# Altium project PCB_Project_Node_Sensor.PrjPcb
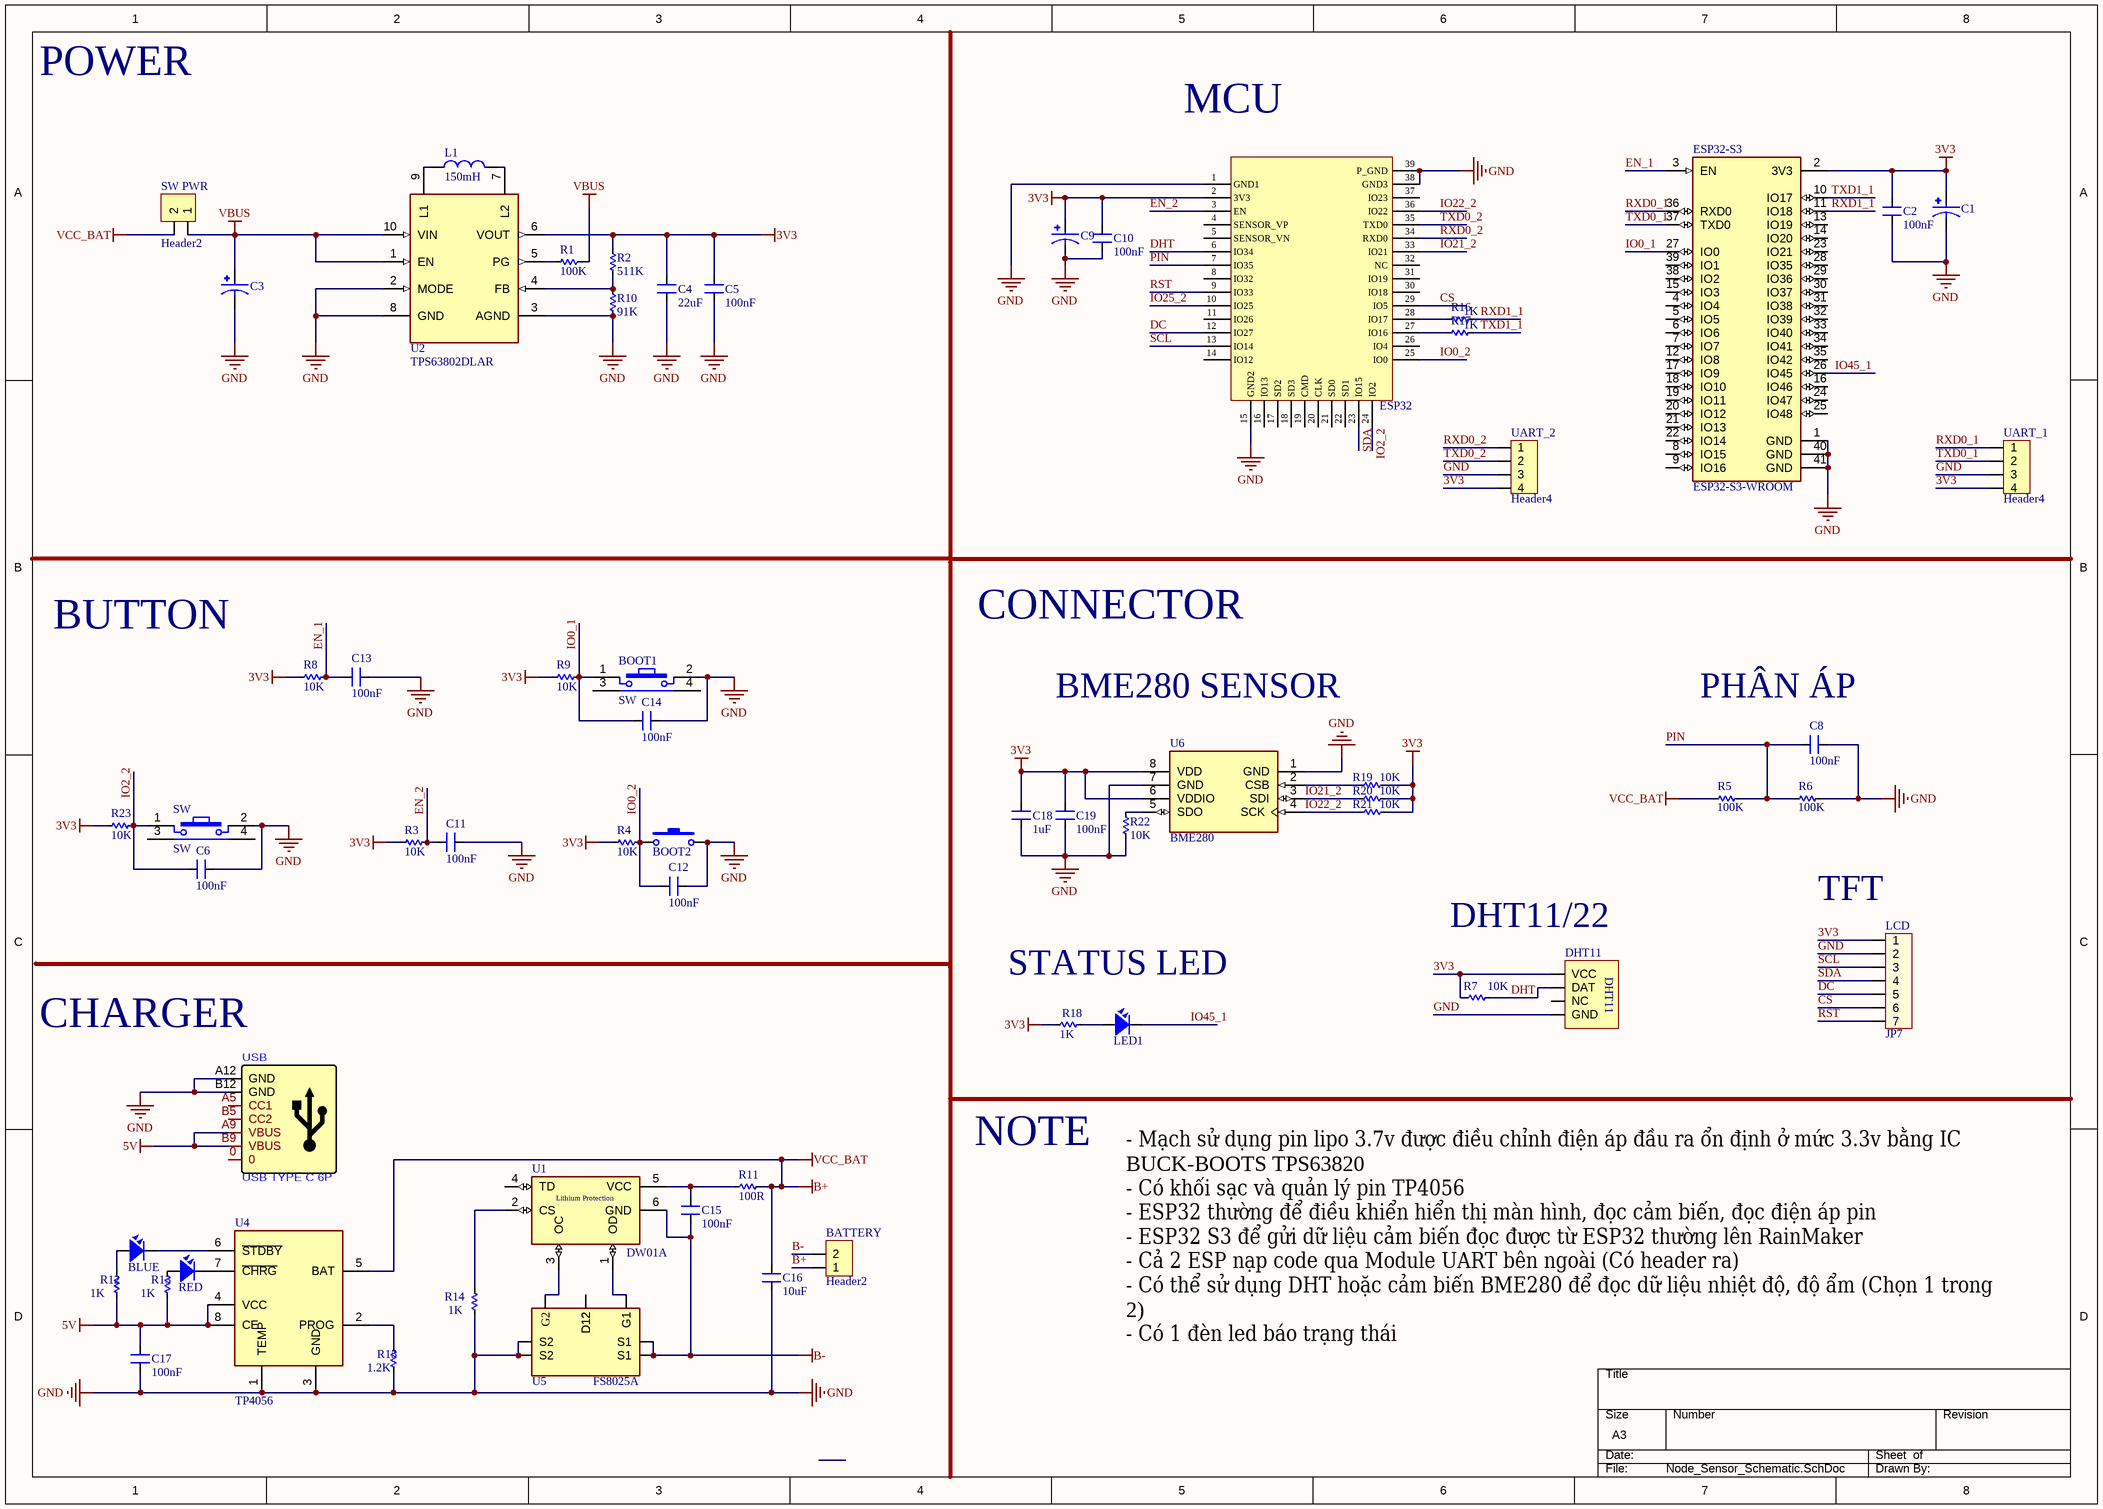
[diagram p0: Node_Sensor_Schematic.SchDoc]
1 sheet, 62 parts. Net scope: global (net labels, ports and power ports of the same name join across sheets).
Board file: PCB1.PcbDoc

## Sheet Node_Sensor_Schematic.SchDoc: Node_Sensor
size A3; Author: Chu Hà Nam; SheetNumber: 1; SheetTotal: 1

### Parts
BATTERY  Header2  [Header2]
BLUE  LED  [LED-0603]  (value not drawn)
BOOT1  SW  [TACTILE SWITCH TC-0203]
BOOT2  SW-SMD  [SW_B3U-1000P]  (value not drawn)
C1  CAP_TANTALUM_SMD  [CAP_TANTALUM_3216]  (value not drawn)
C2  100nF  [C-0603]
C3  10uF/16V  [CAP_TANTALUM_3216]  (value not drawn)
C4  22uF  [SM-0805]
C5  100nF  [SM-0805]
C6  100nF  [C-0603]
C8  100nF  [C-0603]
C9  CAP_TANTALUM_SMD  [CAP_TANTALUM_3216]  (value not drawn)
C10  100nF  [C-0603]
C11  100nF  [C-0603]
C12  100nF  [C-0603]
C13  100nF  [C-0603]
C14  100nF  [C-0603]
C15  100nF  [C-0603]
C16  10uF  [SM-0805]
C17  100nF  [C-0603]
C18  1uF  [C-0603]
C19  100nF  [C-0603]
DHT11  DHT11  [DHT11]  (value not drawn)
ESP32  ESP32  [ESP32-WROOM-32U]  (value not drawn)
ESP32-S3  ESP32-S3-WROOM  [ESP32-S3-WROOM-1]
L1  150mH  [INDUCTOR_SMD_4X4MM]
LCD  JP7  [653007114822]
LED1  LED  [LED-0603]  (value not drawn)
R1  100K  [RES-SMD-0603]
R2  511K  [RES-SMD-0603]
R3  10K  [RES-SMD-0603]
R4  10K  [RES-SMD-0603]
R5  100K  [RES-SMD-0603]
R6  100K  [RES-SMD-0603]
R7  10K  [RES-SMD-0603]
R8  10K  [RES-SMD-0603]
R9  10K  [RES-SMD-0603]
R10  91K  [RES-SMD-0603]
R11  100R  [RES-SMD-0603]
R12  1K  [RES-SMD-0603]
R13  1K  [RES-SMD-0603]
R14  1K  [RES-SMD-0603]
R15  1.2K  [RES-SMD-0603]
R16  1K  [RES-SMD-0603]
R17  1K  [RES-SMD-0603]
R18  1K  [RES-SMD-0603]
R19  10K  [RES-SMD-0603]
R20  10K  [RES-SMD-0603]
R21  10K  [RES-SMD-0603]
R22  10K  [RES-SMD-0603]
R23  10K  [RES-SMD-0603]
RED  LED  [LED-0603]  (value not drawn)
SW  SW  [TACTILE SWITCH TC-0203]
SW_PWR  Header2  [Header2]
U1  DW01A  [SOT23-6]
U2  TPS63802DLAR  [TPS63802DLAR]
U4  TP4056  [SOP127P600X175-9N]
U5  FS8025A  [TSSOP-8]
U6  BME280  [BME280 SENSOR]
UART_1  Header4  [PAD_4]
UART_2  Header4  [PAD_4]
USB  USB TYPE C 6P  [TYPE-C-SMD_TYPE-C-6P_C9900001460]

### Nets
3V3: C1.1 C2.2 C4.2 C5.2 C9.1 C10.2 C18.1 C19.1 DHT11.1(VCC) ESP32.2(3V3) ESP32-S3.2(3V3) LCD.1 R2.1 R3.2 R4.2 R7.1 R8.2 R9.2 R18.2 R19.1 R20.1 R21.1 R23.2 U2.6(VOUT) U6.6(VDDIO) U6.8(VDD) UART_1.4 UART_2.4
5V: C17.2 R12.2 R13.2 U4.4(VCC) U4.8(CE) USB.A9(VBUS) USB.B9(VBUS)
B+: BATTERY.1 C16.2 R5.1 R11.2 SW_PWR.2 U4.5(BAT)  [also labelled VCC_BAT]
B-: BATTERY.2 C15.1 U1.6(GND) U5.2(S1) U5.3(S1)
GND: BOOT1.2 BOOT2.2 C1.2 C2.1 C3.2 C4.1 C5.1 C6.1 C8.1 C9.2 C10.1 C11.1 C12.1 C13.1 C14.1 C16.1 C17.1 C18.2 C19.2 DHT11.4(GND) ESP32.1(GND1) ESP32.15(GND2) ESP32.38(GND3) ESP32.39(P_GND) ESP32-S3.1(GND) ESP32-S3.40(GND) ESP32-S3.41(GND) LCD.2 R6.2 R10.2 R14.2 R15.2 R22.1 SW.2 U2.2(MODE) U2.3(AGND) U2.8(GND) U4.1(TEMP) U4.3(GND) U5.6(S2) U5.7(S2) U6.1(GND) U6.7(GND) UART_1.3 UART_2.3 USB.A12(GND) USB.B12(GND)
VBUS: C3.1 R1.2 SW_PWR.1 U2.1(EN) U2.10(VIN)
CS: ESP32.29(IO5) LCD.6
DC: ESP32.12(IO27) LCD.5
DHT: DHT11.2(DAT) ESP32.6(IO34) R7.2
EN_1: C13.2 ESP32-S3.3(EN) R8.1
EN_2: C11.2 ESP32.3(EN) R3.1
IO0_1: BOOT1.1 C14.2 ESP32-S3.27(IO0) R9.1
IO0_2: BOOT2.1 C12.2 ESP32.25(IO0) R4.1
IO2_2: C6.2 ESP32.24(IO2) R23.1 SW.1
IO21_2: ESP32.33(IO21) R20.2 U6.3(SDI)
IO22_2: ESP32.36(IO22) R21.2 U6.4(SCK)
IO25_2: ESP32.10(IO25)
IO45_1: ESP32-S3.26(IO45) LED1.2
PIN: C8.2 ESP32.7(IO35) R5.2 R6.1
RST: ESP32.9(IO33) LCD.7
RXD0_1: ESP32-S3.36(RXD0) UART_1.1
RXD0_2: ESP32.34(RXD0) UART_2.1
RXD1_1: ESP32-S3.11(IO18) R16.1
SCL: ESP32.13(IO14) LCD.3
SDA: ESP32.23(IO15) LCD.4
TXD0_1: ESP32-S3.37(TXD0) UART_1.2
TXD0_2: ESP32.35(TXD0) UART_2.2
TXD1_1: ESP32-S3.10(IO17) R17.1
NetBLUE_1: BLUE.1 R12.1
NetBLUE_2: BLUE.2 U4.6(~{STDBY})
NetC15_2: C15.2 R11.1 U1.5(VCC)
NetESP32_27: ESP32.27(IO16) R17.2
NetESP32_28: ESP32.28(IO17) R16.2
NetL1_1: L1.1 U2.9(L1)
NetL1_2: L1.2 U2.7(L2)
NetLED1_1: LED1.1 R18.1
NetR1_1: R1.1 U2.5(PG)
NetR2_2: R2.2 R10.1 U2.4(FB)
NetR13_1: R13.1 RED.1
NetR14_1: R14.1 U1.2(CS)
NetR15_1: R15.1 U4.2(PROG)
NetR19_2: R19.2 U6.2(CSB)
NetR22_2: R22.2 U6.5(SDO)
NetRED_2: RED.2 U4.7(~{CHRG})
NetU1_1: U1.1(OD) U5.4(G1)
NetU1_3: U1.3(OC) U5.5(G2)
NetU5_1: U5.1(D12) U5.8(D12)

Not connected (* = marked no-connect by the designer): BOOT1 3 4; DHT11 3(NC); ESP32 4(SENSOR_VP) 5(SENSOR_VN) 8(IO32) 11(IO26) 14(IO12) 16(IO13) 17(SD2) 18(SD3) 19(CMD) 20(CLK) 21(SD0) 22(SD1) 26(IO4) 30(IO18) 31(IO19) 32(NC) 37(IO23); ESP32-S3 4(IO4) 5(IO5) 6(IO6) 7(IO7) 8(IO15) 9(IO16) 12(IO8) 13(IO19) 14(IO20) 15(IO3) 16(IO46) 17(IO9) 18(IO10) 19(IO11) 20(IO12) 21(IO13) 22(IO14) 23(IO21) 24(IO47) 25(IO48) 28(IO35) 29(IO36) 30(IO37) 31(IO38) 32(IO39) 33(IO40) 34(IO41) 35(IO42) 38(IO2) 39(IO1); SW 3 4; U1 4(TD); USB 0 A5(CC1) B5(CC2)

### Notes on the sheet
- POWER
- (near ESP32) MCU
- BUTTON
- CONNECTOR
- BME280 SENSOR
- (near C8) PHÂN ÁP
- (near LCD) TFT
- STATUS LED
- (near DHT11) DHT11/22
- CHARGER
- NOTE
- - Mạch sử dụng pin lipo 3.7v được điều chỉnh điện áp đầu ra ổn định ở mức 3.3v bằng IC BUCK-BOOTS TPS63820
  - Có khối sạc và quản lý pin TP4056
  - ESP32 thường để điều khiển hiển thị màn hình, đọc cảm biến, đọc điện áp pin
  - ESP32 S3 để gửi dữ liệu cảm biến đọc được từ ESP32 thường lên RainMaker
  - Cả 2 ESP nạp code qua Module UART bên ngoài (Có header ra)
  - Có thể sử dụng DHT hoặc cảm biến BME280 để đọc dữ liệu nhiệt độ, độ ẩm (Chọn 1 trong 2)
  - Có 1 đèn led báo trạng thái
  - Có 1 nút nhấn nối với chân IO0 của ESP32 S3 được đặt ở rìa mạch để thực hiện thao tác Factory reset bên ngoài vỏ hộp
- THIS DOCUMENT AND THE DATA DISCLOSED HEREIN OR
- HEREWITH IS THE PROPERTY OF ALTIUM LIMITED AND MAY
- DWG NO:
- REVISION
- REV:
- DESCRIPTION
- DATE
- APPROVED
- BE FREELY DISTRIBUTED IN WHOLE. NO RIGHTS ARE
- RESERVED OR EXPRESS OR IMPLIED WARANTEE GIVEN.
- ENG:
- APPROVALS
- PROJECT
- DSN:
- CHK:
- REFERENCE DOCUMENTS
- PROJECT REVISION:
- TITLE
- DOCUMENT REVISION:
- DESIGN ITEM:
- BOM:
- FAB DWG:
- PCB DWG:
- ASSY DWG:
- SCALE:
- A3
- SIZE
- CAGE CODE
- FILE NAME
- DWG NO.
- SHEET
- OF
- REV
- (in symbol DW01A) Lithium Protection

### Library data of the parts
BATTERY SW_PWR = Header2: Header IDC, 2 x 1 Pin Vertical 2.54mm Pitch (Non-Boxed, Male); Manufacturer: W¨¹rth Elektronik eiSos GmbH; partNo: 613002143121; ComponentLink1 Description: Manufacturer; ComponentLink2 Description: Datasheet; NoPins: 02; Created Date: 29 March 2013; ComponentLink1URL: http://www.we-online.com; ComponentLink2URL: http://katalog.we-online.de/em/datasheet/6130xx143121.pdf; Created by: Karrer Zheng
BLUE LED1 RED = LED SMD: Value: LED 3 - 5 ly 2 Colour
BOOT1 SW = SW4-DIP: Switch button 4 pin; Value: Button chip 4 pin
BOOT2 = SW-SMD: Switch; Published: 24-Mar-1999; LatestRevisionDate: 17-Jul-2002; LatestRevisionNote: Re-released for DXP Platform.; PackageReference: SPST-2; Publisher: Altium Limited
C1 C3 C9 = CAP_TANTALUM_SMD: Capacitor, Tantalum; MF: AVX; MP: TAJB475K025RNJ; SnapEDA_Link: https://www.snapeda.com/parts/TAJB475K025RNJ/AVX/view-part/?ref=snap; Package: 1411 AVX Corporation; Value: *; Check_prices: https://www.snapeda.com/parts/TAJB475K025RNJ/AVX/view-part/?ref=eda
C2 C4-C6 C8 C10-C19 = CM: Cap SMD; Value: 103
DHT11 = DHT11: Manufacturer: W¨¹rth Elektronik eiSos GmbH; partNo: 613004143121; ComponentLink1 Description: Manufacturer; ComponentLink2 Description: Datasheet; NoPins: 04; Created Date: 29 March 2013; ComponentLink1URL: http://www.we-online.com; ComponentLink2URL: http://katalog.we-online.de/em/datasheet/6130xx143121.pdf; Created by: Karrer Zheng
ESP32 = ESP-WROOM-32
ESP32-S3 = ESP32-S3-WROOM: MF: {'manufacturer': u'Espressif Systems'}; MP: ESP32-S3-WROOM-1-N8; Package: None; Price: None; Value: *; Availability: Unavailable
L1 = Inductor_SMD: Inductor; Value: 150 mH
LCD = Header7: Connector 7; Value: Connector 7
R1-R23 = Res-SMD: Resistor; Manufacturer: Generic Components; Class: Passive; Published: 08/06/2000; Publisher: Altium Hobart Technology Centre
U1 = DW01A: One Cell Lithium-ion/Polymer Battery Protection IC; MF: Fortune Semiconductor; SnapEDA_Link: https://www.snapeda.com/parts/DW01A/Fortune+Semiconductor/view-part/?ref=snap; Package: SOT-23-6 Fortune Semiconductor; Value: *; MP: DW01A; Check_prices: https://www.snapeda.com/parts/DW01A/Fortune+Semiconductor/view-part/?ref=eda
U2 = TPS63802DLAR: 2-A, high-efficient, 11-ÂµA quiescent current buck-boost converter in QFN/DFN package; MF: Texas Instruments; Check_prices: https://www.snapeda.com/parts/TPS63802DLAR/Texas+Instruments/view-part/?ref=eda; Value: *; Availability: In Stock; MP: TPS63802DLAR; Price: None; Package: VSON-HR-10 Texas Instruments; SnapEDA_Link: https://www.snapeda.com/parts/TPS63802DLAR/Texas+Instruments/view-part/?ref=snap; Purchase-URL: https://pricing.snapeda.com/search/part/TPS63802DLAR/?ref=eda
U4 = TP4056: Complete single cell Li-Ion battery with a constant current / constant voltage linear charger; MF: NanJing Top Power ASIC Corp.; Check_prices: https://www.snapeda.com/parts/TP4056/NanJing+Top+Power+ASIC+Corp./view-part/?ref=eda; SnapEDA_Link: https://www.snapeda.com/parts/TP4056/NanJing+Top+Power+ASIC+Corp./view-part/?ref=snap; Price: None; Availability: Not in stock; Package: Package; MP: TP4056; Value: *
U5 = FS8025A: MOSFET N-2CH TSSOP-8; MP: M24C64-DFDW6TP; Package: None; Price: None; Value: *; Availability: Unavailable
U6 = BME280: DIGITAL HUMIDITY, PRESSURE AND TEMPERATURE SENSOR<br>* Digital interface IÂ²C (up to 3.4 MHz) and SPI (3 and 4 wire, up to 10 MHz)* Supply voltage VDD main supply voltage range: 1.71 V to 3.6 V*VDDIO interface voltage range: 1.2 V to 3.6 V<br> Operating range -40â€¦+85 Â°C, 0â€¦100 % rel. humidity, 300â€¦1100 hPa <br><br>  The library has been designed by<a href="https://www.facebook.com/groups/eaglecadsoftUK"> Richard Magdycz</a>; Package: None; Availability: Unavailable; MP: BME280; Value: *; Price: None
UART_1 UART_2 = Header4: Header IDC, 4 x 1 Pin Vertical 2.54mm Pitch (Non-Boxed, Male); Manufacturer: W¨¹rth Elektronik eiSos GmbH; partNo: 613002143121; ComponentLink1 Description: Manufacturer; ComponentLink2 Description: Datasheet; NoPins: 02; Created Date: 29 March 2013; ComponentLink1URL: http://www.we-online.com; ComponentLink2URL: http://katalog.we-online.de/em/datasheet/6130xx143121.pdf; Created by: Karrer Zheng
USB = USB TYPE C 6P: UJC-HP-3-SMT-TR